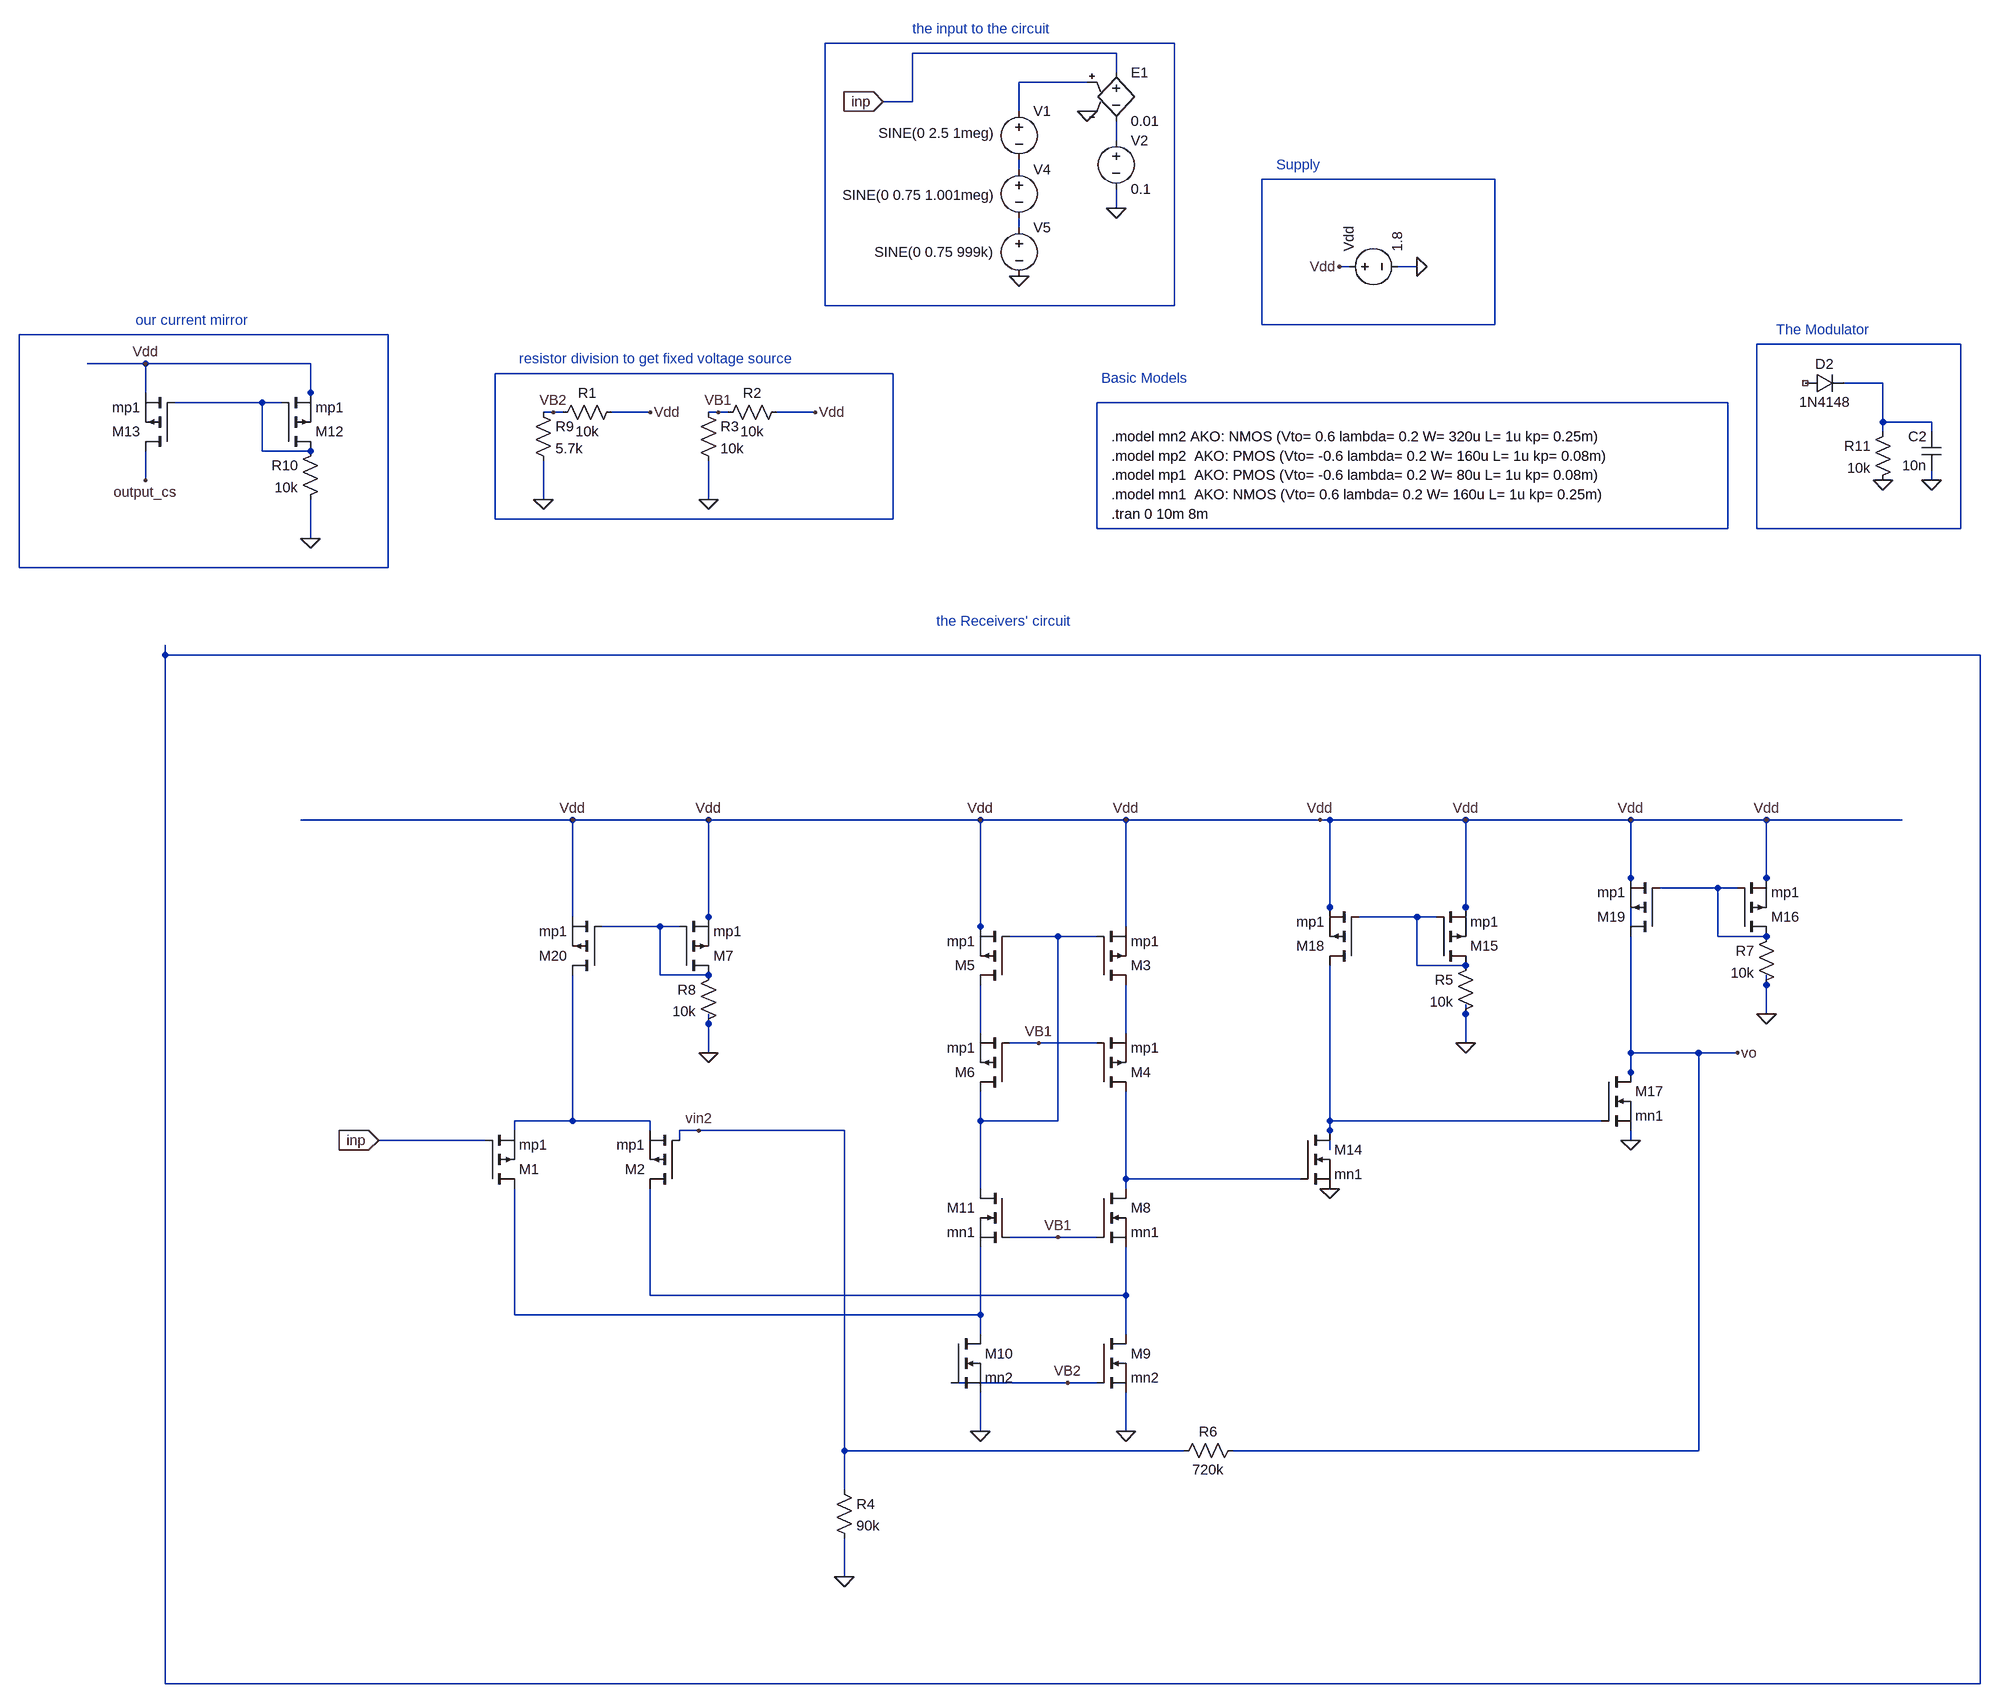
[diagram p0: schematic Receiver.asc]
Receiver.asc, the LTspice schematic file:
Version 4
SHEET 1 3424 1188
WIRE 1456 -1520 880 -1520
WIRE 1360 -1504 1024 -1504
WIRE 1360 -1472 1360 -1504
WIRE 1312 -1456 1200 -1456
WIRE 1024 -1424 1024 -1504
WIRE 1024 -1424 976 -1424
WIRE 1200 -1408 1200 -1456
WIRE 1360 -1360 1360 -1392
WIRE 1200 -1312 1200 -1328
WIRE 1984 -1296 1600 -1296
WIRE 1360 -1248 1360 -1280
WIRE 1200 -1216 1200 -1232
WIRE 1744 -1152 1728 -1152
WIRE 1856 -1152 1824 -1152
WIRE 880 -1088 880 -1520
WIRE 1456 -1088 1456 -1520
WIRE 1456 -1088 880 -1088
WIRE 1600 -1056 1600 -1296
WIRE 1984 -1056 1984 -1296
WIRE 1984 -1056 1600 -1056
WIRE 160 -1040 -448 -1040
WIRE 2752 -1024 2416 -1024
WIRE -240 -992 -336 -992
WIRE 32 -992 -240 -992
WIRE 992 -976 336 -976
WIRE 2624 -960 2560 -960
WIRE -240 -944 -240 -992
WIRE 32 -944 32 -992
WIRE -48 -928 -192 -928
WIRE -16 -928 -48 -928
WIRE 32 -928 32 -944
WIRE 2368 -928 1328 -928
WIRE 432 -912 416 -912
WIRE 448 -912 432 -912
WIRE 592 -912 528 -912
WIRE 704 -912 688 -912
WIRE 720 -912 704 -912
WIRE 864 -912 800 -912
WIRE 2624 -896 2624 -960
WIRE 2704 -896 2624 -896
WIRE 2624 -880 2624 -896
WIRE 2704 -880 2704 -896
WIRE -48 -848 -48 -928
WIRE 32 -848 -48 -848
WIRE -240 -800 -240 -848
WIRE 2704 -800 2704 -816
WIRE 416 -768 416 -832
WIRE 688 -768 688 -832
WIRE 336 -736 336 -976
WIRE 992 -736 992 -976
WIRE 992 -736 336 -736
WIRE 1328 -720 1328 -928
WIRE 2368 -720 2368 -928
WIRE 2368 -720 1328 -720
WIRE 2416 -720 2416 -1024
WIRE 2752 -720 2752 -1024
WIRE 2752 -720 2416 -720
WIRE 32 -704 32 -768
WIRE -448 -656 -448 -1040
WIRE 160 -656 160 -1040
WIRE 160 -656 -448 -656
WIRE -208 -512 -208 -528
WIRE 2784 -512 -208 -512
WIRE 464 -240 16 -240
WIRE 688 -240 464 -240
WIRE 1136 -240 688 -240
WIRE 1376 -240 1136 -240
WIRE 1696 -240 1376 -240
WIRE 1712 -240 1696 -240
WIRE 1936 -240 1712 -240
WIRE 2208 -240 1936 -240
WIRE 2432 -240 2208 -240
WIRE 2656 -240 2432 -240
WIRE 2208 -144 2208 -240
WIRE 2432 -144 2432 -240
WIRE 2352 -128 2256 -128
WIRE 2384 -128 2352 -128
WIRE 2432 -128 2432 -144
WIRE 1712 -96 1712 -240
WIRE 1936 -96 1936 -240
WIRE 464 -80 464 -240
WIRE 688 -80 688 -240
WIRE 1712 -80 1712 -96
WIRE 1856 -80 1760 -80
WIRE 1888 -80 1856 -80
WIRE 1936 -80 1936 -96
WIRE 608 -64 512 -64
WIRE 640 -64 608 -64
WIRE 688 -64 688 -80
WIRE 1136 -64 1136 -240
WIRE 1376 -64 1376 -240
WIRE 2208 -64 2208 -144
WIRE 1136 -48 1136 -64
WIRE 1264 -48 1184 -48
WIRE 1328 -48 1264 -48
WIRE 2352 -48 2352 -128
WIRE 2432 -48 2352 -48
WIRE 1856 0 1856 -80
WIRE 1936 0 1856 0
WIRE 608 16 608 -64
WIRE 688 16 608 16
WIRE 2432 32 2432 16
WIRE 1936 80 1936 64
WIRE 2432 80 2432 32
WIRE 688 96 688 80
WIRE 1136 112 1136 32
WIRE 1376 112 1376 32
WIRE 1232 128 1184 128
WIRE 1328 128 1232 128
WIRE 1936 128 1936 80
WIRE 688 144 688 96
WIRE 2208 144 2208 -48
WIRE 2320 144 2208 144
WIRE 2384 144 2320 144
WIRE 2208 176 2208 144
WIRE 2208 192 2208 176
WIRE 464 256 464 16
WIRE 464 256 368 256
WIRE 592 256 464 256
WIRE 1136 256 1136 208
WIRE 1264 256 1264 -48
WIRE 1264 256 1136 256
WIRE 1712 256 1712 0
WIRE 2160 256 1712 256
WIRE 368 272 368 256
WIRE 592 272 592 256
WIRE 672 272 640 272
WIRE 912 272 672 272
WIRE 1712 272 1712 256
WIRE 320 288 144 288
WIRE 640 288 640 272
WIRE 2208 288 2208 272
WIRE 1712 304 1712 272
WIRE 1376 352 1376 208
WIRE 1664 352 1376 352
WIRE 1136 368 1136 256
WIRE 1376 368 1376 352
WIRE 1264 448 1184 448
WIRE 1328 448 1264 448
WIRE 592 544 592 368
WIRE 1376 544 1376 464
WIRE 1376 544 592 544
WIRE 368 576 368 368
WIRE 1136 576 1136 464
WIRE 1136 576 368 576
WIRE 1136 608 1136 576
WIRE 1376 608 1376 544
WIRE 1280 688 1088 688
WIRE 1328 688 1280 688
WIRE 1136 768 1136 704
WIRE 1376 768 1376 704
WIRE 912 800 912 272
WIRE 1472 800 912 800
WIRE 2320 800 2320 144
WIRE 2320 800 1552 800
WIRE 912 864 912 800
WIRE 912 1008 912 944
WIRE -208 1184 -208 -512
WIRE 2784 1184 2784 -512
WIRE 2784 1184 -208 1184
FLAG 1712 368 0
FLAG 2208 288 0
FLAG 1200 -1136 0
FLAG 1360 -1248 0
FLAG 1312 -1408 0
FLAG 1136 768 0
FLAG 1376 768 0
FLAG 688 -768 0
FLAG 864 -912 Vdd
FLAG 1280 688 VB2
FLAG 704 -912 VB1
FLAG 1264 448 VB1
FLAG 1232 128 VB1
FLAG 416 -768 0
FLAG 592 -912 Vdd
FLAG 432 -912 VB2
FLAG 912 1008 0
FLAG 2384 144 vo
FLAG 2624 -800 0
FLAG 2704 -800 0
FLAG -240 -800 output_cs
FLAG -240 -992 Vdd
FLAG 32 -704 0
FLAG 688 144 0
FLAG 672 272 vin2
FLAG 1936 128 0
FLAG 1856 -1152 0
FLAG 1728 -1152 Vdd
FLAG 2432 80 0
FLAG 976 -1424 inp
IOPIN 976 -1424 In
FLAG 144 288 inp
IOPIN 144 288 In
FLAG 2432 -240 Vdd
FLAG 2208 -240 Vdd
FLAG 1936 -240 Vdd
FLAG 1696 -240 Vdd
FLAG 1376 -240 Vdd
FLAG 1136 -240 Vdd
FLAG 688 -240 Vdd
FLAG 464 -240 Vdd
DATAFLAG 1088 544 ""
DATAFLAG 912 800 ""
DATAFLAG 16 -848 ""
SYMBOL pmos 320 368 M180
SYMATTR InstName M1
SYMATTR Value mp1
SYMBOL pmos 640 368 R180
SYMATTR InstName M2
SYMATTR Value mp1
SYMBOL pmos 1328 32 M180
SYMATTR InstName M3
SYMATTR Value mp1
SYMBOL pmos 1328 208 M180
SYMATTR InstName M4
SYMATTR Value mp1
SYMBOL pmos 1184 32 R180
SYMATTR InstName M5
SYMATTR Value mp1
SYMBOL pmos 1184 208 R180
SYMATTR InstName M6
SYMATTR Value mp1
SYMBOL nmos 1328 368 R0
SYMATTR InstName M8
SYMATTR Value mn1
SYMBOL nmos 1328 608 R0
SYMATTR InstName M9
SYMATTR Value mn2
SYMBOL nmos 1088 608 R0
SYMATTR InstName M10
SYMATTR Value mn2
SYMBOL nmos 1184 368 M0
SYMATTR InstName M11
SYMATTR Value mn1
SYMBOL res 816 -928 R90
WINDOW 0 0 56 VBottom 2
WINDOW 3 32 56 VTop 2
SYMATTR InstName R2
SYMATTR Value 10k
SYMBOL res 672 -928 R0
SYMATTR InstName R3
SYMATTR Value 10k
SYMBOL nmos 1664 272 R0
SYMATTR InstName M14
SYMATTR Value mn1
SYMBOL nmos 2160 176 R0
SYMATTR InstName M17
SYMATTR Value mn1
SYMBOL voltage 1200 -1424 R0
WINDOW 123 0 0 Left 0
WINDOW 39 0 0 Left 0
WINDOW 3 -232 52 Left 2
SYMATTR Value SINE(0 2.5 1meg)
SYMATTR InstName V1
SYMBOL voltage 1200 -1328 R0
WINDOW 123 0 0 Left 0
WINDOW 39 0 0 Left 0
WINDOW 3 -291 58 Left 2
SYMATTR Value SINE(0 0.75 1.001meg)
SYMATTR InstName V4
SYMBOL voltage 1200 -1232 R0
WINDOW 123 0 0 Left 0
WINDOW 39 0 0 Left 0
WINDOW 3 -238 56 Left 2
SYMATTR Value SINE(0 0.75 999k)
SYMATTR InstName V5
SYMBOL e 1360 -1488 R0
SYMATTR InstName E1
SYMATTR Value 0.01
SYMBOL voltage 1360 -1376 R0
WINDOW 123 0 0 Left 0
WINDOW 39 0 0 Left 0
SYMATTR InstName V2
SYMATTR Value 0.1
SYMBOL res 544 -928 R90
WINDOW 0 0 56 VBottom 2
WINDOW 3 32 56 VTop 2
SYMATTR InstName R1
SYMATTR Value 10k
SYMBOL res 400 -928 R0
SYMATTR InstName R9
SYMATTR Value 5.7k
SYMBOL res 896 848 R0
SYMATTR InstName R4
SYMATTR Value 90k
SYMBOL res 1568 784 R90
WINDOW 0 0 56 VBottom 2
WINDOW 3 32 56 VTop 2
SYMATTR InstName R6
SYMATTR Value 720k
SYMBOL res 2640 -896 M0
SYMATTR InstName R11
SYMATTR Value 10k
SYMBOL diode 2496 -944 R270
WINDOW 0 32 32 VTop 2
WINDOW 3 0 32 VBottom 2
SYMATTR InstName D2
SYMATTR Value 1N4148
SYMBOL cap 2720 -880 M0
SYMATTR InstName C2
SYMATTR Value 10n
SYMBOL pmos -16 -848 M180
SYMATTR InstName M12
SYMATTR Value mp1
SYMBOL res 48 -864 M0
SYMATTR InstName R10
SYMATTR Value 10k
SYMBOL pmos -192 -848 R180
SYMATTR InstName M13
SYMATTR Value mp1
SYMBOL pmos 640 16 M180
SYMATTR InstName M7
SYMATTR Value mp1
SYMBOL pmos 512 16 R180
SYMATTR InstName M20
SYMATTR Value mp1
SYMBOL res 704 0 M0
SYMATTR InstName R8
SYMATTR Value 10k
SYMBOL pmos 1888 0 M180
SYMATTR InstName M15
SYMATTR Value mp1
SYMBOL pmos 1760 0 R180
SYMATTR InstName M18
SYMATTR Value mp1
SYMBOL res 1952 -16 M0
SYMATTR InstName R5
SYMATTR Value 10k
SYMBOL voltage 1728 -1152 R270
WINDOW 123 0 0 Left 0
WINDOW 39 0 0 Left 0
SYMATTR InstName Vdd
SYMATTR Value 1.8
SYMBOL pmos 2384 -48 M180
SYMATTR InstName M16
SYMATTR Value mp1
SYMBOL pmos 2256 -48 R180
SYMATTR InstName M19
SYMATTR Value mp1
SYMBOL res 2448 -64 M0
SYMATTR InstName R7
SYMATTR Value 10k
TEXT 1352 -808 Left 2 !.model mp1  AKO: PMOS (Vto= -0.6 lambda= 0.2 W= 80u L= 1u kp= 0.08m)
TEXT 1352 -776 Left 2 !.model mn1  AKO: NMOS (Vto= 0.6 lambda= 0.2 W= 160u L= 1u kp= 0.25m)
TEXT 1352 -840 Left 2 !.model mp2  AKO: PMOS (Vto= -0.6 lambda= 0.2 W= 160u L= 1u kp= 0.08m)
TEXT 1352 -872 Left 2 !.model mn2 AKO: NMOS (Vto= 0.6 lambda= 0.2 W= 320u L= 1u kp= 0.25m)
TEXT 1352 -744 Left 2 !.tran 0 10m 8m
TEXT 2448 -1048 Left 2 ;The Modulator
TEXT 1336 -968 Left 2 ;Basic Models
TEXT 376 -1000 Left 2 ;resistor division to get fixed voltage source
TEXT -256 -1064 Left 2 ;our current mirror
TEXT 1024 -1544 Left 2 ;the input to the circuit
TEXT 1624 -1320 Left 2 ;Supply
TEXT 1064 -568 Left 2 ;the Receivers' circuit

The netlist it stands for:
* Receiver.asc
M1 N024 inp N020 N020 mp1
M2 N023 vin2 N020 N020 mp1
M3 N019 N017 Vdd Vdd mp1
M4 N022 VB1 N019 N019 mp1
M5 N018 N017 Vdd Vdd mp1
M6 N017 VB1 N018 N018 mp1
M8 N022 VB1 N023 N023 mn1
M9 N023 VB2 0 0 mn2
M10 N024 VB2 0 0 mn2
M11 N017 VB1 N024 N024 mn1
R2 Vdd VB1 10k
R3 VB1 0 10k
M14 N021 N022 0 0 mn1
M17 vo N021 0 0 mn1
V1 N002 N004 SINE(0 2.5 1meg)
V4 N004 N006 SINE(0 0.75 1.001meg)
V5 N006 0 SINE(0 0.75 999k)
E1 inp N003 N002 0 0.01
V2 N003 0 0.1
R1 Vdd VB2 10k
R9 VB2 0 5.7k
R4 vin2 0 90k
R6 vo vin2 720k
R11 N010 0 10k
D2 NC_01 N010 1N4148
C2 N010 0 10n
M12 N011 N011 Vdd Vdd mp1
R10 N011 0 10k
M13 output_cs N011 Vdd Vdd mp1
M7 N016 N016 Vdd Vdd mp1
M20 N020 N016 Vdd Vdd mp1
R8 N016 0 10k
M15 N015 N015 Vdd Vdd mp1
M18 N021 N015 Vdd Vdd mp1
R5 N015 0 10k
Vdd Vdd 0 1.8
M16 N014 N014 Vdd Vdd mp1
M19 vo N014 Vdd Vdd mp1
R7 N014 0 10k
.model D D
.lib standard.dio
.model NMOS NMOS
.model PMOS PMOS
.lib standard.mos
.model mp1  AKO: PMOS (Vto= -0.6 lambda= 0.2 W= 80u L= 1u kp= 0.08m)
.model mn1  AKO: NMOS (Vto= 0.6 lambda= 0.2 W= 160u L= 1u kp= 0.25m)
.model mp2  AKO: PMOS (Vto= -0.6 lambda= 0.2 W= 160u L= 1u kp= 0.08m)
.model mn2 AKO: NMOS (Vto= 0.6 lambda= 0.2 W= 320u L= 1u kp= 0.25m)
.tran 0 10m 8m
* The Modulator
* Basic Models
* resistor division to get fixed voltage source
* our current mirror
* the input to the circuit
* Supply
* the Receivers' circuit
.backanno
.end